# Altium schematic sheet FlightComputer.SchDoc
size 381 x 241 mm
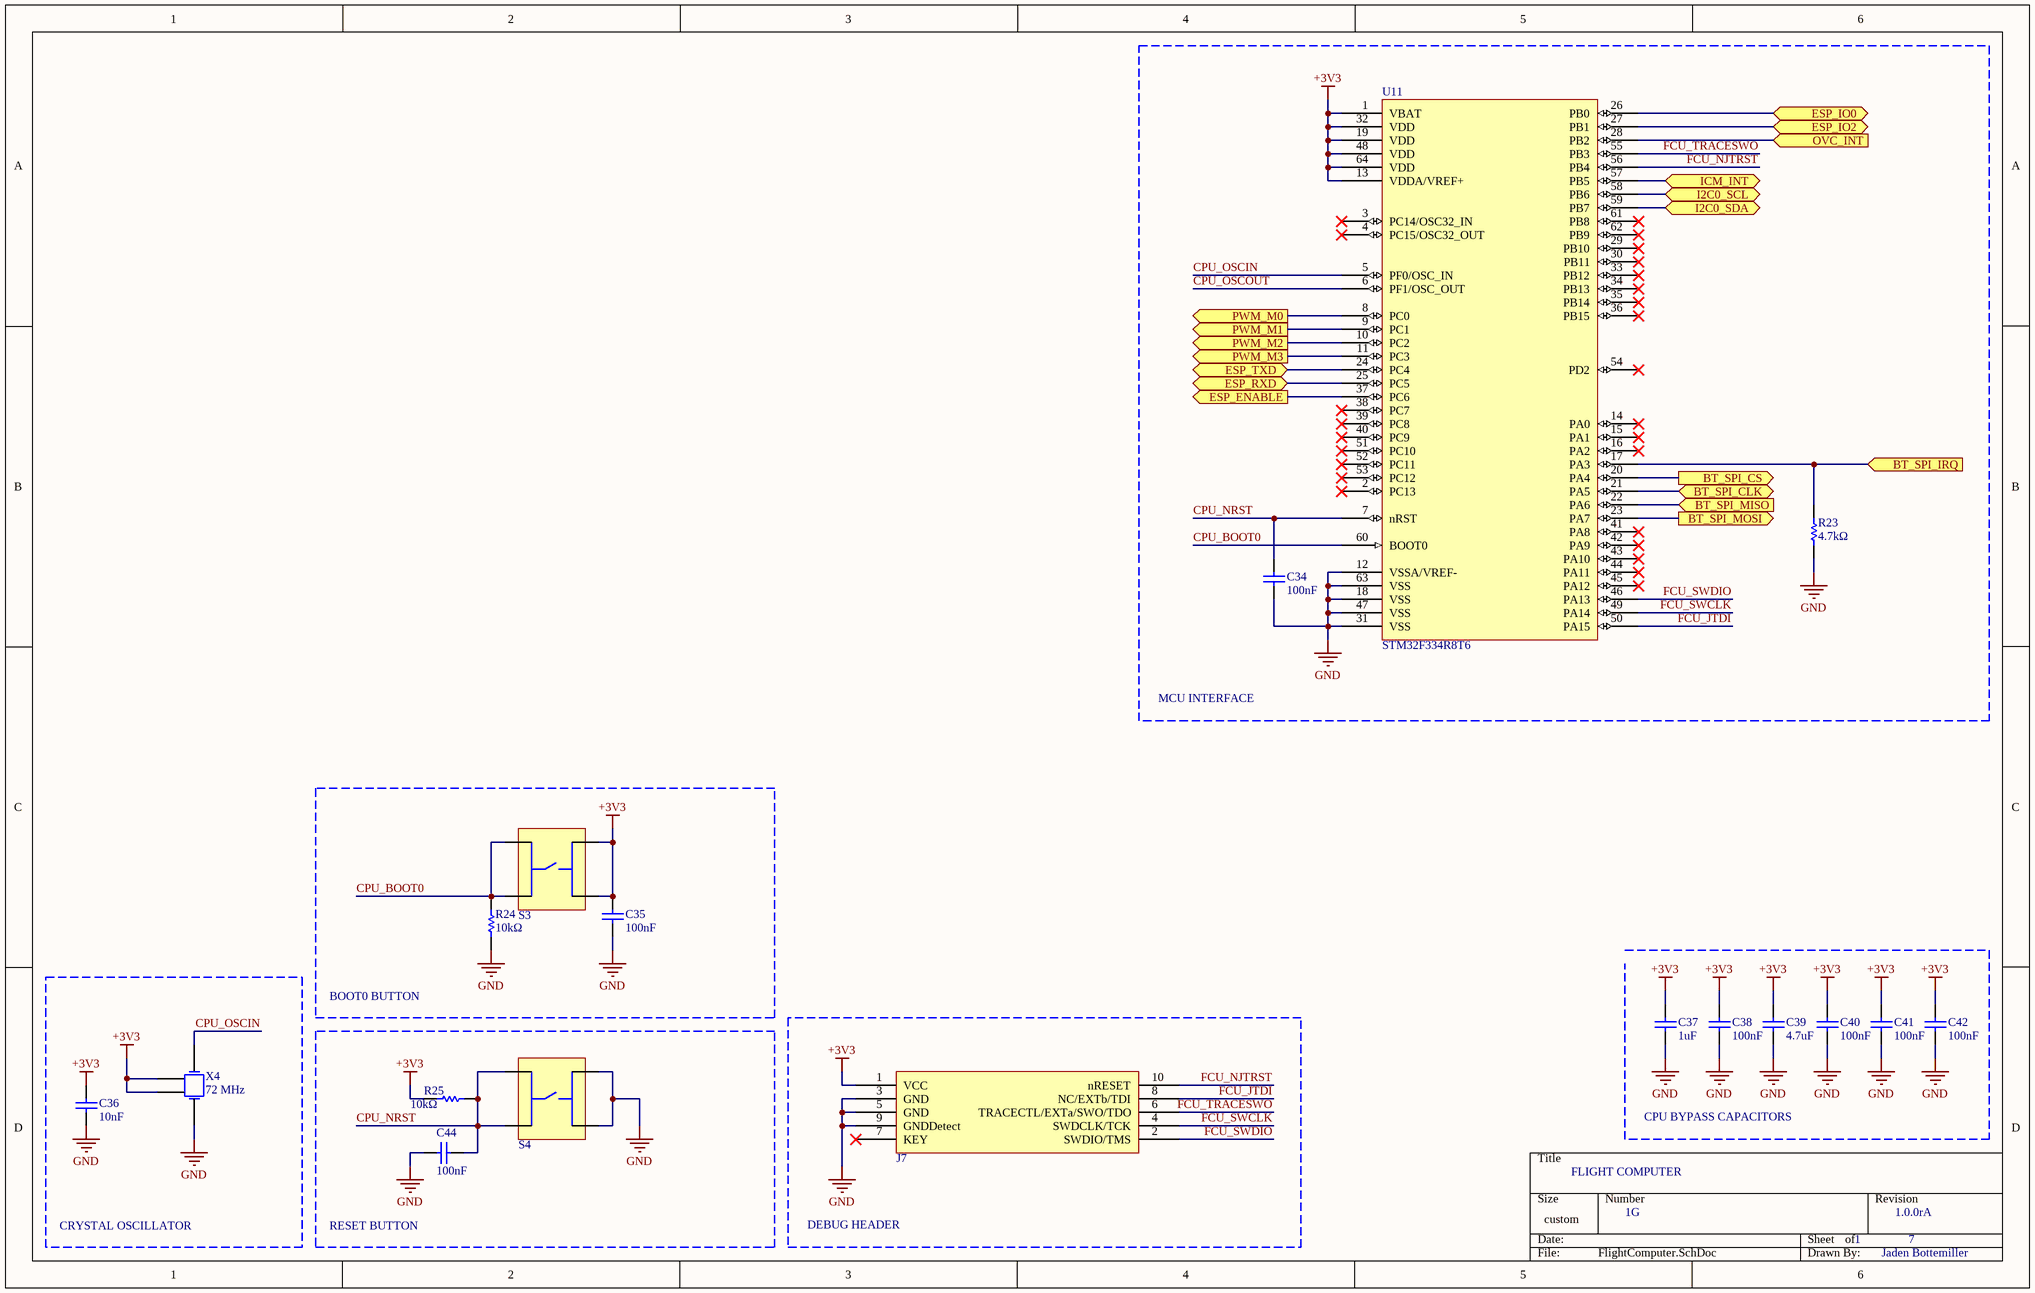
[diagram p0: FlightComputer.SchDoc]

## Parts
C34  value 100nF  (hidden comment: CAP)
C35  value 100nF  (hidden comment: CAP)
C36  value 10nF  (hidden comment: CAP)
C37  value 1uF  (hidden comment: CAP)
C38  value 100nF  (hidden comment: CAP)
C39  value 4.7uF  (hidden comment: CAP)
C40  value 100nF  (hidden comment: CAP)
C41  value 100nF  (hidden comment: CAP)
C42  value 100nF  (hidden comment: CAP)
C44  value 100nF  (hidden comment: CAP)
J7  Debug Connector  (value not drawn)
R23  value 4.7kΩ  (hidden comment: RES)
R24  value 10kΩ  (hidden comment: RES)
R25  value 10kΩ  (hidden comment: RES)
S3  Pushbutton  (value not drawn)
S4  Pushbutton  (value not drawn)
U11  STM32F334R8T6
X4  value 72 MHz  (hidden comment: Crystal Oscillator)

## Blocks framed on the sheet
MCU INTERFACE: C34 R23 U11
BOOT0 BUTTON: C35 R24 S3
CRYSTAL OSCILLATOR: C36 X4
RESET BUTTON: C44 R25 S4
DEBUG HEADER: J7

## Ports
BT_SPI_CLK (bidir), BT_SPI_CS (out), BT_SPI_IRQ (in), BT_SPI_MISO (in), BT_SPI_MOSI (out), ESP_ENABLE (out), ESP_IO0 (bidir), ESP_IO2 (bidir), ESP_RXD (bidir), ESP_TXD (bidir), I2C0_SCL (bidir), I2C0_SDA (bidir), ICM_INT (bidir), OVC_INT (in), PWM_M0 (out), PWM_M1 (out), PWM_M2 (out), PWM_M3 (out)

## Nets
+3V3: C35.1 C36.1 C37.2 C38.2 C39.2 C40.2 C41.2 C42.2 J7.1(VCC) R25.1 S3.3(Pin) S3.4(Pin) U11.1(VBAT) U11.13(VDDA/VREF+) U11.19(VDD) U11.32(VDD) U11.48(VDD) U11.64(VDD) X4.2(GND) X4.4(GND)
GND: C34.1 C35.2 C36.2 C37.1 C38.1 C39.1 C40.1 C41.1 C42.1 C44.2 J7.3(GND) J7.5(GND) J7.9(GNDDetect) R23.1 R24.1 S4.3(Pin) S4.4(Pin) U11.12(VSSA/VREF-) U11.18(VSS) U11.31(VSS) U11.47(VSS) U11.63(VSS) X4.3(X2)
BT_SPI_CLK: U11.21(PA5) ; port BT_SPI_CLK
BT_SPI_CS: U11.20(PA4) ; port BT_SPI_CS
BT_SPI_IRQ: R23.2 U11.17(PA3) ; port BT_SPI_IRQ
BT_SPI_MISO: U11.22(PA6) ; port BT_SPI_MISO
BT_SPI_MOSI: U11.23(PA7) ; port BT_SPI_MOSI
CPU_BOOT0: R24.2 S3.1 S3.2(Pin) U11.60(BOOT0)
CPU_NRST: C34.2 C44.1 R25.2 S4.1 S4.2(Pin) U11.7(nRST)
CPU_OSCIN: U11.5(PF0/OSC_IN) X4.1(X1)
CPU_OSCOUT: U11.6(PF1/OSC_OUT)
ESP_ENABLE: U11.37(PC6) ; port ESP_ENABLE
ESP_IO0: U11.26(PB0) ; port ESP_IO0
ESP_IO2: U11.27(PB1) ; port ESP_IO2
ESP_RXD: U11.25(PC5) ; port ESP_RXD
ESP_TXD: U11.24(PC4) ; port ESP_TXD
FCU_JTDI: J7.8(NC/EXTb/TDI) U11.50(PA15)
FCU_NJTRST: J7.10(nRESET) U11.56(PB4)
FCU_SWCLK: J7.4(SWDCLK/TCK) U11.49(PA14)
FCU_SWDIO: J7.2(SWDIO/TMS) U11.46(PA13)
FCU_TRACESWO: J7.6(TRACECTL/EXTa/SWO/TDO) U11.55(PB3)
I2C0_SCL: U11.58(PB6) ; port I2C0_SCL
I2C0_SDA: U11.59(PB7) ; port I2C0_SDA
ICM_INT: U11.57(PB5) ; port ICM_INT
OVC_INT: U11.28(PB2) ; port OVC_INT
PWM_M0: U11.8(PC0) ; port PWM_M0
PWM_M1: U11.9(PC1) ; port PWM_M1
PWM_M2: U11.10(PC2) ; port PWM_M2
PWM_M3: U11.11(PC3) ; port PWM_M3

Not connected (* = marked no-connect by the designer): J7 7(KEY)*; U11 2(PC13)* 3(PC14/OSC32_IN)* 4(PC15/OSC32_OUT)* 14(PA0)* 15(PA1)* 16(PA2)* 29(PB10)* 30(PB11)* 33(PB12)* 34(PB13)* 35(PB14)* 36(PB15)* 38(PC7)* 39(PC8)* 40(PC9)* 41(PA8)* 42(PA9)* 43(PA10)* 44(PA11)* 45(PA12)* 51(PC10)* 52(PC11)* 53(PC12)* 54(PD2)* 61(PB8)* 62(PB9)*

## Notes on the sheet
- FLIGHT COMPUTER
- CPU BYPASS CAPACITORS
- 1G
- 1
- 1.0.0rA
- 7
- Jaden Bottemiller

## Library data of the parts
C34-C42 C44 = CAP: Standard Capacitor
J7 = Cortex-M Debug: 10-Pin Cortex-M Debug Connector
R23-R25 = RES: Standard Resistor
S3 S4 = PUSHBTN_4T: Standard Pushbutton with 4 Terminals
U11 = STM32F334R8T6: ARM® Cortex®-M4 STM32F3 Microcontroller IC 32-Bit 72MHz 64KB (64K x 8) FLASH 64-LQFP (10x10); ComponentLink1Description: DigiKey; ComponentLink1URL: https://www.digikey.com/product-detail/en/stmicroelectronics/STM32F334R8T6/497-14955-ND/4989177; ComponentLink2Description: Datasheet; ComponentLink2URL: https://www.st.com/content/ccc/resource/technical/document/datasheet/d1/cd/3d/18/a2/2c/4e/d0/DM00097745.pdf/files/DM00097745.pdf/jcr:content/translations/en.DM00097745.pdf
X4 = OSC_2GND: Standard Crystal Oscillator with two ground connections.